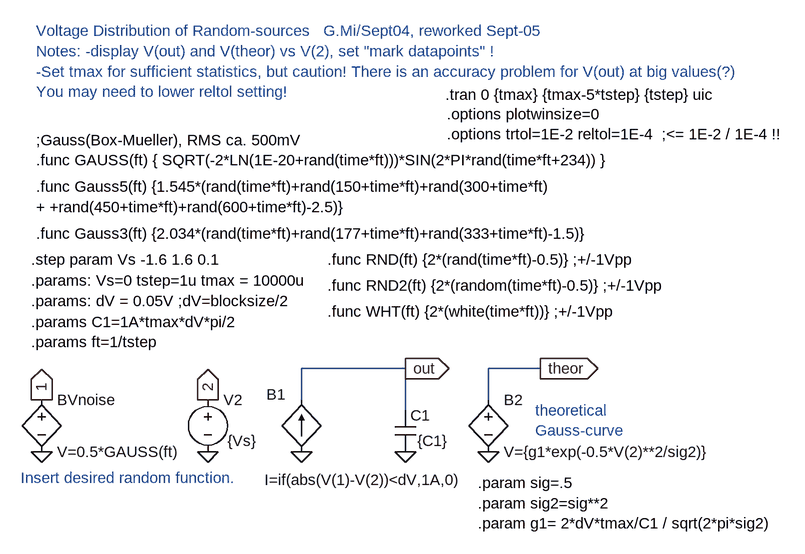
[diagram p0: schematic Random_Volt_Distrib.asc]
Random_Volt_Distrib.asc, the LTspice schematic file:
Version 4
SHEET 1 1660 680
WIRE 432 128 432 80
WIRE 592 80 432 80
WIRE 592 144 592 80
WIRE 720 128 720 80
WIRE 800 80 720 80
FLAG 432 208 0
FLAG 592 208 0
FLAG 592 80 out
IOPIN 592 80 Out
FLAG 288 128 2
IOPIN 288 128 Out
FLAG 288 208 0
FLAG 32 208 0
FLAG 32 128 1
IOPIN 32 128 Out
FLAG 720 208 0
FLAG 800 80 theor
IOPIN 800 80 Out
SYMBOL bi 432 208 R180
WINDOW 0 24 88 Left 0
WINDOW 3 -248 -43 Left 0
SYMATTR InstName B1
SYMATTR Value I=if(abs(V(1)-V(2))<dV,1A,0)
SYMBOL cap 576 144 R0
WINDOW 3 35 47 Left 0
SYMATTR Value {C1}
SYMATTR InstName C1
SYMBOL voltage 288 112 R0
WINDOW 3 30 79 Left 0
WINDOW 123 0 0 Left 0
WINDOW 39 0 0 Left 0
SYMATTR Value {Vs}
SYMATTR InstName V2
SYMBOL bv 32 112 R0
SYMATTR InstName BVnoise
SYMATTR Value V=0.5*GAUSS(ft)
SYMBOL bv 720 112 R0
SYMATTR InstName B2
SYMATTR Value V={g1*exp(-0.5*V(2)**2/sig2)}
TEXT 654 -342 Left 0 !.tran 0 {tmax} {tmax-5*tstep} {tstep} uic
TEXT 16 8 Left 0 !.params C1=1A*tmax*dV*pi/2\n.params ft=1/tstep
TEXT 16 -88 Left 0 !.step param Vs -1.6 1.6 0.1
TEXT 16 -24 Left 0 !.params: dV = 0.05V ;dV=blocksize/2
TEXT 472 -88 Left 0 !.func RND(ft) {2*(rand(time*ft)-0.5)} ;+/-1Vpp
TEXT 24 -440 Left 0 ;Voltage Distribution of Random-sources   G.Mi/Sept04, reworked Sept-05\nNotes: -display V(out) and V(theor) vs V(2), set "mark datapoints" !\n-Set tmax for sufficient statistics, but caution! There is an accuracy problem for V(out) at big values(?)\nYou may need to lower reltol setting!
TEXT 472 -8 Left 0 !.func WHT(ft) {2*(white(time*ft))} ;+/-1Vpp
TEXT 472 -48 Left 0 !.func RND2(ft) {2*(random(time*ft)-0.5)} ;+/-1Vpp
TEXT 0 248 Left 0 ;Insert desired random function.
TEXT 24 -272 Left 0 !;Gauss(Box-Mueller), RMS ca. 500mV\n.func GAUSS(ft) { SQRT(-2*LN(1E-20+rand(time*ft)))*SIN(2*PI*rand(time*ft+234)) }
TEXT 24 -200 Left 0 !.func Gauss5(ft) {1.545*(rand(time*ft)+rand(150+time*ft)+rand(300+time*ft)\n+ +rand(450+time*ft)+rand(600+time*ft)-2.5)}
TEXT 16 -56 Left 0 !.params: Vs=0 tstep=1u tmax = 10000u
TEXT 24 -128 Left 0 !.func Gauss3(ft) {2.034*(rand(time*ft)+rand(177+time*ft)+rand(333+time*ft)-1.5)}
TEXT 704 256 Left 0 !.param sig=.5\n.param sig2=sig**2\n.param g1= 2*dV*tmax/C1 / sqrt(2*pi*sig2)
TEXT 792 144 Left 0 ;theoretical\nGauss-curve
TEXT 656 -312 Left 0 !.options plotwinsize=0\n.options trtol=1E-2 reltol=1E-4  ;<= 1E-2 / 1E-4 !!

The netlist it stands for:
* Random_Volt_Distrib.asc
B1 0 out I=if(abs(V(1)-V(2))<dV,1A,0)
C1 out 0 {C1}
V2 2 0 {Vs}
BVnoise 1 0 V=0.5*GAUSS(ft)
B2 theor 0 V={g1*exp(-0.5*V(2)**2/sig2)}
.tran 0 {tmax} {tmax-5*tstep} {tstep} uic
.params C1=1A*tmax*dV*pi/2
.params ft=1/tstep
.step param Vs -1.6 1.6 0.1
.params: dV = 0.05V ;dV=blocksize/2
.func RND(ft) {2*(rand(time*ft)-0.5)} ;+/-1Vpp
* Voltage Distribution of Random-sources   G.Mi/Sept04, reworked Sept-05
* Notes: -display V(out) and V(theor) vs V(2), set "mark datapoints" !
* -Set tmax for sufficient statistics, but caution! There is an accuracy problem for V(out) at big values(?)
* You may need to lower reltol setting!
.func WHT(ft) {2*(white(time*ft))} ;+/-1Vpp
.func RND2(ft) {2*(random(time*ft)-0.5)} ;+/-1Vpp
* Insert desired random function.
;Gauss(Box-Mueller), RMS ca. 500mV
.func GAUSS(ft) { SQRT(-2*LN(1E-20+rand(time*ft)))*SIN(2*PI*rand(time*ft+234)) }
.func Gauss5(ft) {1.545*(rand(time*ft)+rand(150+time*ft)+rand(300+time*ft)
+ +rand(450+time*ft)+rand(600+time*ft)-2.5)}
.params: Vs=0 tstep=1u tmax = 10000u
.func Gauss3(ft) {2.034*(rand(time*ft)+rand(177+time*ft)+rand(333+time*ft)-1.5)}
.param sig=.5
.param sig2=sig**2
.param g1= 2*dV*tmax/C1 / sqrt(2*pi*sig2)
* theoretical
* Gauss-curve
.options plotwinsize=0
.options trtol=1E-2 reltol=1E-4  ;<= 1E-2 / 1E-4 !!
.backanno
.end